# EAGLE schematic Steering_Wheel_rev0 (EAGLE 7.6.0)
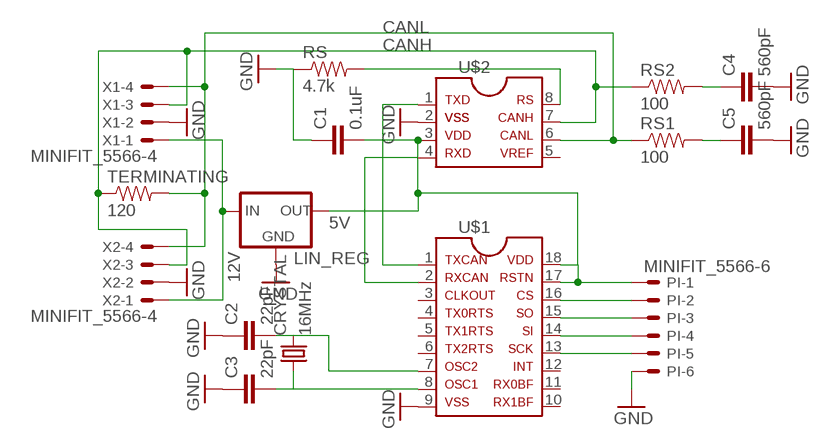
[diagram p0: schematic, sheet 1]

## Parts
C1  0.1uF  CAP0805  [0805]
C2  22pF  CAP0805  [0805]
C3  22pF  CAP0805  [0805]
C4  560pF  CAP0805  [0805]
C5  560pF  CAP0805  [0805]
CRYSTAL  16MHz  CRYSTALSMD  [HC49UP]
LIN_REG  5V_REGULATOR_LM340-NLM340MPX-5.0/NOPB  [SOT223]
PI  MINIFIT_5566-6  [MINIFIT_5566-6]
RS  4.7k  RESISTOR0805-RES  [0805]
RS1  100  RESISTOR0805-RES  [0805]
RS2  100  RESISTOR0805-RES  [0805]
TERMINATING  120  RESISTOR0805-RES  [0805]
U$1  MCP2515SMD  [SOIC-18W]
U$2  MCP2551  [SOIC-08]
X1  MINIFIT_5566-4  [MINIFIT_5566-4]
X2  MINIFIT_5566-4  [MINIFIT_5566-4]

## Nets
5V: C1.2 LIN_REG.3(OUT) PI.1 U$1.17 U$1.18 U$2.3
12V: LIN_REG.1(IN) X1.1 X2.1
CANH: RS2.1 TERMINATING.1 U$2.7 X1.3 X2.3
CANL: RS1.1 TERMINATING.2 U$2.6 X1.4 X2.4
GND: C1.1 C2.1 C3.1 C4.2 C5.2 LIN_REG.2(GND) LIN_REG.4(GND) PI.6 RS.1 U$1.9 U$2.2 X1.2 X2.2
N$1: U$1.1 U$2.1
N$2: U$1.2 U$2.4
N$3: C3.2 CRYSTAL.1 U$1.8
N$4: PI.2 U$1.16
N$5: PI.3 U$1.15
N$6: PI.4 U$1.14
N$7: PI.5 U$1.13
N$8: RS.2 U$2.8
N$9: C2.2 CRYSTAL.2 U$1.7
N$10: C4.1 RS2.2
N$11: C5.1 RS1.2
Unconnected: U$1.3 U$1.4 U$1.5 U$1.6 U$1.10 U$1.11 U$1.12 U$2.5

## Library data of the parts
C1-C5 = HyTechDevices:CAP: Capacitor Standard 0603 ceramic capacitor, and 0.1" leaded capacitor.
CRYSTAL = HyTechDevices:CRYSTAL: Various standard crystals. Proven footprints. Source: Sparkfun <https://github.com/sparkfun/SparkFun-Eagle-Libraries>
LIN_REG = HyTechDevices:5V_REGULATOR_LM340-N: Voltage Regulator 5v linear voltage regulator Datasheet <http://www.mouser.com/ProductDetail/Texas-Instruments/LM340MPX-50-NOPB/?qs=X1J7HmVL2ZGZwtTFRQ9ItA%3D%3D> MAX current out: 1.5A MAX voltage in: 35V
PI = HyTechDevices:MINIFIT_5566-6: Mini-Fit Junior connector 6 pole Source: http://www.molex.com; MPN: 95566-61002; OC_FARNELL: unknown; OC_NEWARK: 22K8620
RS RS1 RS2 TERMINATING = HyTechDevices:RESISTOR: Resistor Basic schematic elements and footprints for 0603, 1206, and PTH resistors.
U$1 = HyTechDevices:MCP2515: MCP2515 CAN Controller with SPI Interface Datasheet <http://ww1.microchip.com/downloads/en/DeviceDoc/21801G.pdf>
U$2 = HyTechDevices:MCP2551: MCP2551 High-Speed CAN Transceiver Product Webpage <https://www.microchip.com/wwwproducts/en/MCP2551> Datasheet <http://ww1.microchip.com/downloads/en/DeviceDoc/21667f.pdf> This device is outdated It is replaced by MCP2561. Comparison Page <https://www.microchip.com/wwwproducts/ProductCompare/MCP2551/MCP2561> Product Webpage <https://www.microchip.com/wwwproducts/en/MCP2561> Datasheet <http://ww1.microchip.com/downloads/en/DeviceDoc/20005167C.pdf>
X1 X2 = HyTechDevices:MINIFIT_5566-4: Mini-Fit Junior connector 4 pole Source: http://www.molex.com; OC_FARNELL: unknown; OC_NEWARK: unknown